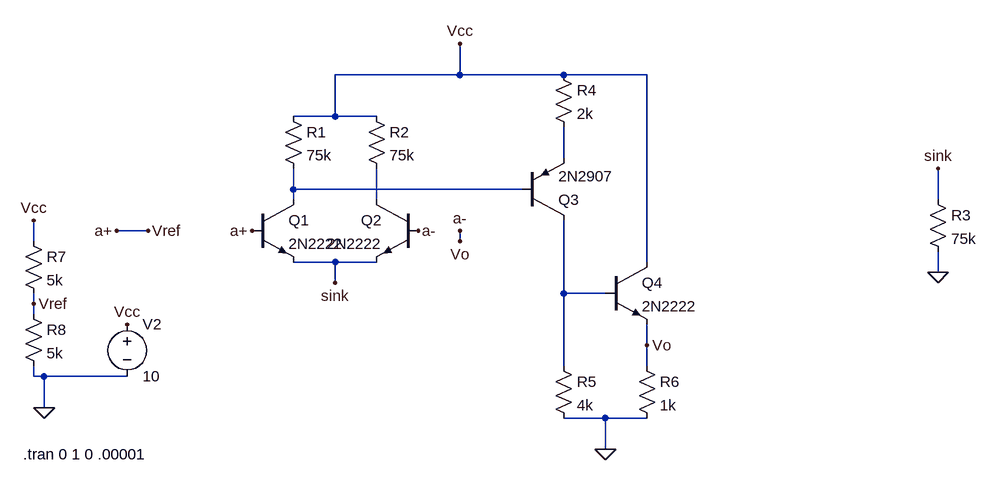
[diagram p0: schematic bjt redriver.asc]
bjt redriver.asc, the LTspice schematic file:
Version 4.1
SHEET 1 1508 680
WIRE 432 -288 432 -336
WIRE 432 -288 240 -288
WIRE 592 -288 432 -288
WIRE 720 -288 592 -288
WIRE 240 -224 240 -288
WIRE 240 -224 176 -224
WIRE 304 -224 240 -224
WIRE 592 -160 592 -208
WIRE 176 -112 176 -144
WIRE 528 -112 176 -112
WIRE 176 -96 176 -112
WIRE 304 -96 304 -144
WIRE 1168 -96 1168 -144
WIRE -48 -48 -96 -48
WIRE -224 -32 -224 -64
WIRE 432 -32 432 -48
WIRE 240 0 176 0
WIRE 304 0 240 0
WIRE 720 0 720 -288
WIRE 1168 16 1168 -16
WIRE 240 32 240 0
WIRE 592 48 592 -64
WIRE 656 48 592 48
WIRE -224 64 -224 48
WIRE -224 80 -224 64
WIRE 720 128 720 96
WIRE 592 160 592 48
WIRE 720 160 720 128
WIRE -224 176 -224 160
WIRE -208 176 -224 176
WIRE -80 176 -208 176
WIRE -208 224 -208 176
WIRE 656 240 592 240
WIRE 720 240 656 240
WIRE 656 288 656 240
FLAG -208 224 0
FLAG -80 96 Vcc
FLAG 656 288 0
FLAG 432 -336 Vcc
FLAG 368 -48 a-
FLAG 112 -48 a+
FLAG 720 128 Vo
FLAG -48 -48 Vref
FLAG -96 -48 a+
FLAG 432 -48 a-
FLAG 432 -32 Vo
FLAG 240 32 sink
FLAG 1168 -144 sink
FLAG 1168 16 0
FLAG -224 -64 Vcc
FLAG -224 64 Vref
SYMBOL voltage -80 80 R0
WINDOW 123 0 0 Left 0
WINDOW 39 0 0 Left 0
SYMATTR InstName V2
SYMATTR Value 10
SYMBOL npn 112 -96 R0
SYMATTR InstName Q1
SYMATTR Value 2N2222
SYMBOL npn 368 -96 M0
SYMATTR InstName Q2
SYMATTR Value 2N2222
SYMBOL res 160 -240 R0
SYMATTR InstName R1
SYMATTR Value 75k
SYMBOL res 288 -240 R0
SYMATTR InstName R2
SYMATTR Value 75k
SYMBOL pnp 528 -64 M180
SYMATTR InstName Q3
SYMATTR Value 2N2907
SYMBOL npn 656 0 R0
SYMATTR InstName Q4
SYMATTR Value 2N2222
SYMBOL res 576 -304 R0
SYMATTR InstName R4
SYMATTR Value 2k
SYMBOL res 576 144 R0
SYMATTR InstName R5
SYMATTR Value 4k
SYMBOL res 704 144 R0
SYMATTR InstName R6
SYMATTR Value 1k
SYMBOL res 1152 -112 R0
SYMATTR InstName R3
SYMATTR Value 75k
SYMBOL res -240 -48 R0
SYMATTR InstName R7
SYMATTR Value 5k
SYMBOL res -240 64 R0
SYMATTR InstName R8
SYMATTR Value 5k
TEXT -240 296 Left 2 !.tran 0 1 0 .00001

The netlist it stands for:
* bjt redriver.asc
V2 Vcc 0 10
Q1 N002 Vref sink 0 2N2222
Q2 N003 Vo sink 0 2N2222
R1 Vcc N002 75k
R2 Vcc N003 75k
Q3 N004 N002 N001 0 2N2907
Q4 Vcc N004 Vo 0 2N2222
R4 Vcc N001 2k
R5 N004 0 4k
R6 Vo 0 1k
R3 sink 0 75k
R7 Vcc Vref 5k
R8 Vref 0 5k
.model NPN NPN
.model PNP PNP
.lib standard.bjt
.tran 0 1 0 .00001
.backanno
.end